# EAGLE schematic transmitter (EAGLE 9.6.2)
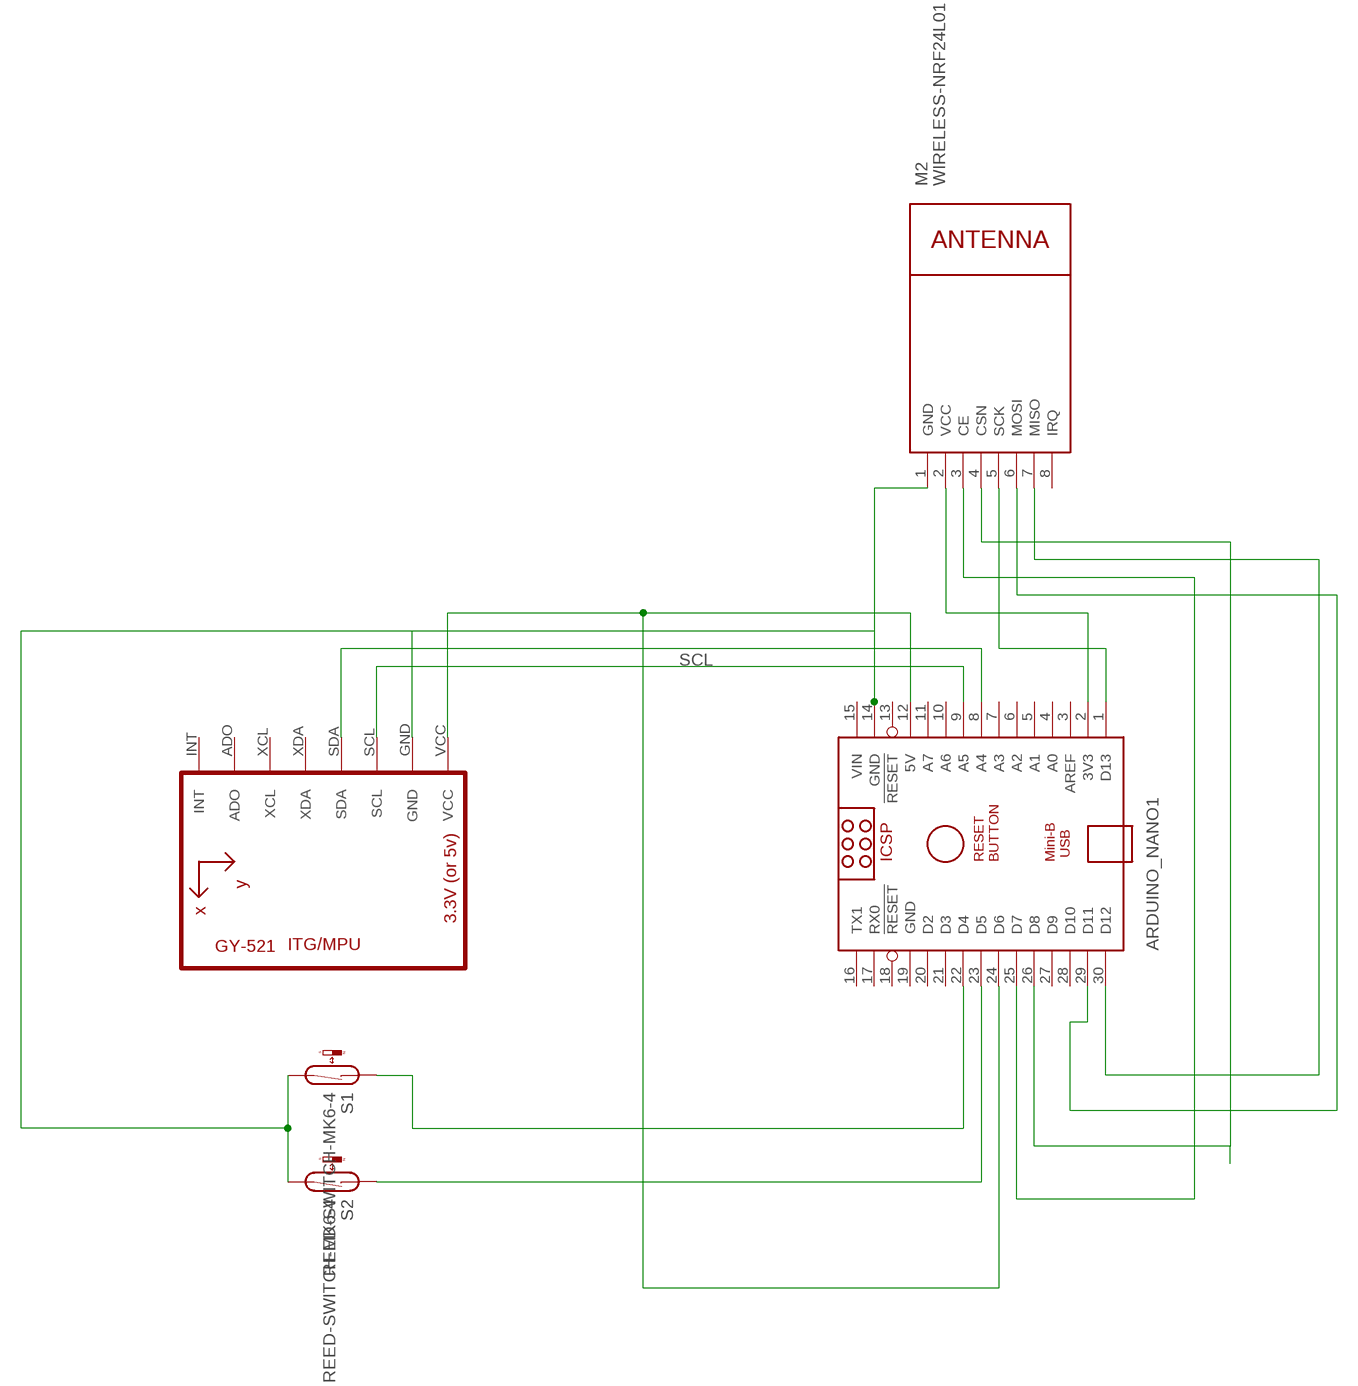
[diagram p0: schematic, sheet 1]

## Parts
ARDUINO_NANO1  ARDUINO_NANO  [ARDUINO_NANO]
M2  WIRELESS-NRF24L01  [WIRELESS-NRF24L01]
S1  REED-SWITCH-MK6-4  [MK6-4]
S2  REED-SWITCH-MK6-4  [MK6-4]
U1  GY-521MPU6050  [GY-521]

## Nets
N$1: ARDUINO_NANO1.22(D4) ARDUINO_NANO1.23(D5) S1.1 S2.1
N$2: ARDUINO_NANO1.8(A4) U1.SDA
N$3: ARDUINO_NANO1.12(5V) ARDUINO_NANO1.24(D6) U1.VCC
N$5: ARDUINO_NANO1.14(GND) M2.1(GND) S1.2 S2.2 U1.GND
N$13: ARDUINO_NANO1.30(D12) M2.7(MISO)
N$14: ARDUINO_NANO1.29(D11) M2.6(MOSI)
N$15: ARDUINO_NANO1.1(D13) M2.5(SCK)
N$16: ARDUINO_NANO1.26(D8) M2.4(CSN)
N$17: ARDUINO_NANO1.2(3V3) M2.2(VCC)
N$18: ARDUINO_NANO1.25(D7) M2.3(CE)
SCL: ARDUINO_NANO1.9(A5) U1.SCL
Unconnected: ARDUINO_NANO1.3(AREF) ARDUINO_NANO1.4(A0) ARDUINO_NANO1.5(A1) ARDUINO_NANO1.6(A2) ARDUINO_NANO1.7(A3) ARDUINO_NANO1.10(A6) ARDUINO_NANO1.11(A7) ARDUINO_NANO1.13(!RESET) ARDUINO_NANO1.16(TX1) ARDUINO_NANO1.17(RX0) ARDUINO_NANO1.18(!RESET) ARDUINO_NANO1.20(D2) ARDUINO_NANO1.21(D3) ARDUINO_NANO1.27(D9) ARDUINO_NANO1.28(D10) M2.8(IRQ) U1.ADO U1.INT U1.XCL U1.XDA

## Power pins joined to a net without a drawn wire
GND: ARDUINO_NANO1.19(GND)
VIN: ARDUINO_NANO1.15(VIN)

## Library data of the parts
ARDUINO_NANO1 = ArduinoNanoV30:ARDUINO_NANO: Arduino Nano V3.0 Overview: The Arduino Nano is a small, complete, and breadboard-friendly board based on the ATmega328 (Arduino Nano 3.x) or ATmega168 (Arduino Nano 2.x). It has more or less the same functionality of the Arduino Duemilanove, but in a different package. It lacks only a DC power jack, and works with a Mini-B USB cable instead of a standard one. The Nano was designed and is being produced by Gravitech. Specifications: Microcontroller Atmel ATmega168 or ATmega328 Operating Voltage (logic level) 5 V Input Voltage (recommended) 7-12 V Input Voltage (limits) 6-20 V Digital I/O Pins 14 (of which 6 provide PWM output) Analog Input Pins 8 DC Current per I/O Pin 40 mA Flash Memory 16 KB (ATmega168) or 32 KB (ATmega328) of which 2 KB used by bootloader SRAM 1 KB (ATmega168) or 2 KB (ATmega328) EEPROM 512 bytes (ATmega168) or 1 KB (ATmega328) Clock Speed 16 MHz Dimensions 0.73" x 1.70" Length 45 mm Width 18 mm Weigth 5 g Power: The Arduino Nano can be powered via the Mini-B USB connection, 6-20V unregulated external power supply (pin 30), or 5V regulated external power supply (pin 27). The power source is automatically selected to the highest voltage source. Memory: The ATmega168 has 16 KB of flash memory for storing code (of which 2 KB is used for the bootloader); the ATmega328 has 32 KB, (also with 2 KB used for the bootloader). The ATmega168 has 1 KB of SRAM and 512 bytes of EEPROM (which can be read and written with the EEPROM library); the ATmega328 has 2 KB of SRAM and 1 KB of EEPROM. Input and Output: Each of the 14 digital pins on the Nano can be used as an input or output, using pinMode(), digitalWrite(), and digitalRead() functions. They operate at 5 volts. Each pin can provide or receive a maximum of 40 mA and has an internal pull-up resistor (disconnected by default) of 20-50 kOhms. In addition, some pins have specialized functions. Visit Arduino - ArduinoBoardNano <https://www.arduino.cc/en/Main/ArduinoBoardNano>
M2 = diy-modules:WIRELESS-NRF24L01: 2.4 GHz Wireless Module based on NRF24L01 chip More details available here: http://www.electrodragon.com/w/NRF24L01 Click here to find device on ebay.com <http://www.ebay.com/sch/nrf24l01+arduino>
S1 S2 = switch-reed:REED-SWITCH-: Reed Sensor; OC_FARNELL: unknown
U1 = gy-521:GY-521